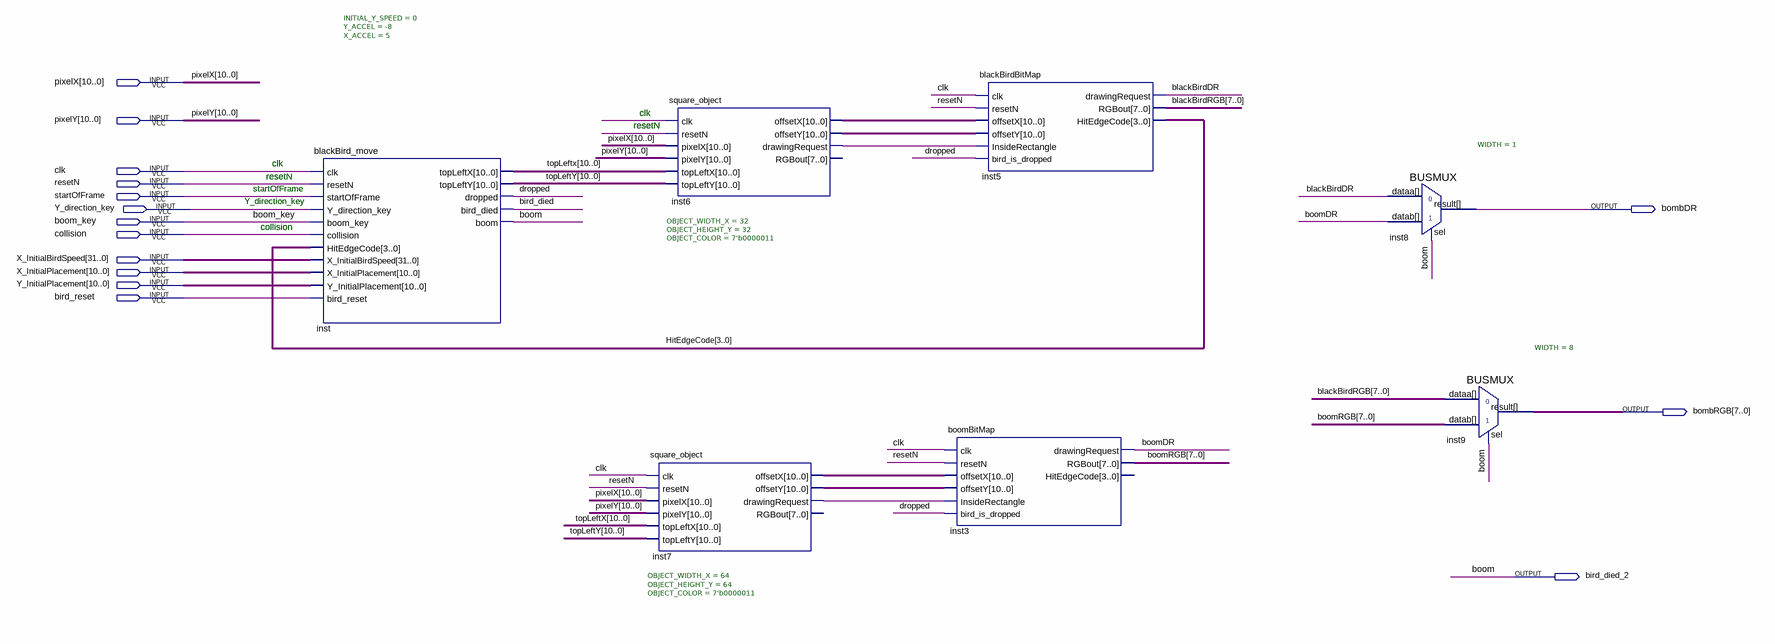
[diagram p0: schematic sheet]
// Quartus schematic BlackBird_Block_T.bdf as structural Verilog: 7 symbols, 15 pins
module BlackBird_Block_T (
  input  [10:0] pixelX,
  input  [10:0] pixelY,
  input  clk,
  input  resetN,
  input  startOfFrame,
  input  Y_direction_key,
  input  boom_key,
  input  collision,
  input  [31:0] X_InitialBirdSpeed,
  input  [10:0] X_InitialPlacement,
  input  [10:0] Y_InitialPlacement,
  input  bird_reset,
  output bombDR,
  output [7:0] bombRGB,
  output bird_died_2
);

  wire bird_died, blackBirdDR, boomDR, dropped, inst6_drawingrequest, inst7_drawingrequest;
  wire [3:0] HitEdgeCode;
  wire [7:0] blackBirdRGB, boomRGB;
  wire [10:0] inst6_offsetx, inst6_offsety, inst7_offsetx, inst7_offsety, topLeftx, topLeftY;

  blackBird_move #(.INITIAL_Y_SPEED(0), .Y_ACCEL(-8), .X_ACCEL(5)) inst (
    .clk(clk), .resetN(resetN), .startOfFrame(startOfFrame), .Y_direction_key(Y_direction_key),
    .boom_key(boom_key), .collision(collision), .HitEdgeCode(HitEdgeCode),
    .X_InitialBirdSpeed(X_InitialBirdSpeed), .X_InitialPlacement(X_InitialPlacement),
    .Y_InitialPlacement(Y_InitialPlacement), .bird_reset(bird_reset), .topLeftX(topLeftx),
    .topLeftY(topLeftY), .dropped(dropped), .bird_died(bird_died), .boom(bird_died_2));
  square_object #(.OBJECT_WIDTH_X(64), .OBJECT_HEIGHT_Y(64), .OBJECT_COLOR(7'b0000011)) inst7 (
    .clk(clk), .resetN(resetN), .pixelX(pixelX), .pixelY(pixelY), .topLeftX(topLeftx), .topLeftY(topLeftY),
    .offsetX(inst7_offsetx), .offsetY(inst7_offsety), .drawingRequest(inst7_drawingrequest));  // open: RGBout
  square_object #(.OBJECT_WIDTH_X(32), .OBJECT_HEIGHT_Y(32), .OBJECT_COLOR(7'b0000011)) inst6 (
    .clk(clk), .resetN(resetN), .pixelX(pixelX), .pixelY(pixelY), .topLeftX(topLeftx), .topLeftY(topLeftY),
    .offsetX(inst6_offsetx), .offsetY(inst6_offsety), .drawingRequest(inst6_drawingrequest));  // open: RGBout
  boomBitMap inst3 (
    .clk(clk), .resetN(resetN), .offsetX(inst7_offsetx), .offsetY(inst7_offsety),
    .InsideRectangle(inst7_drawingrequest), .bird_is_dropped(dropped), .drawingRequest(boomDR),
    .RGBout(boomRGB));  // open: HitEdgeCode
  blackBirdBitMap inst5 (
    .clk(clk), .resetN(resetN), .offsetX(inst6_offsetx), .offsetY(inst6_offsety),
    .InsideRectangle(inst6_drawingrequest), .bird_is_dropped(dropped), .drawingRequest(blackBirdDR),
    .RGBout(blackBirdRGB), .HitEdgeCode(HitEdgeCode));
  BUSMUX #(.WIDTH(1)) inst8 (.datab(boomDR), .sel(bird_died_2), .dataa(blackBirdDR), .result(bombDR));
  BUSMUX #(.WIDTH(8)) inst9 (.datab(boomRGB), .sel(bird_died_2), .dataa(blackBirdRGB), .result(bombRGB));

  // Other names for the same wires on the sheet: boom = bird_died_2

  // Notes on the sheet:
  //   clk
  //   clk
  //   resetN
  //   resetN
  //   clk
  //   resetN
  //   startOfFrame
  //   Y_direction_key
  //   collision 
endmodule
